# EAGLE design PCFX_Mouse_rev_D (EAGLE 9.6.2)
PC Engine Joypad Breakout Version 1.0
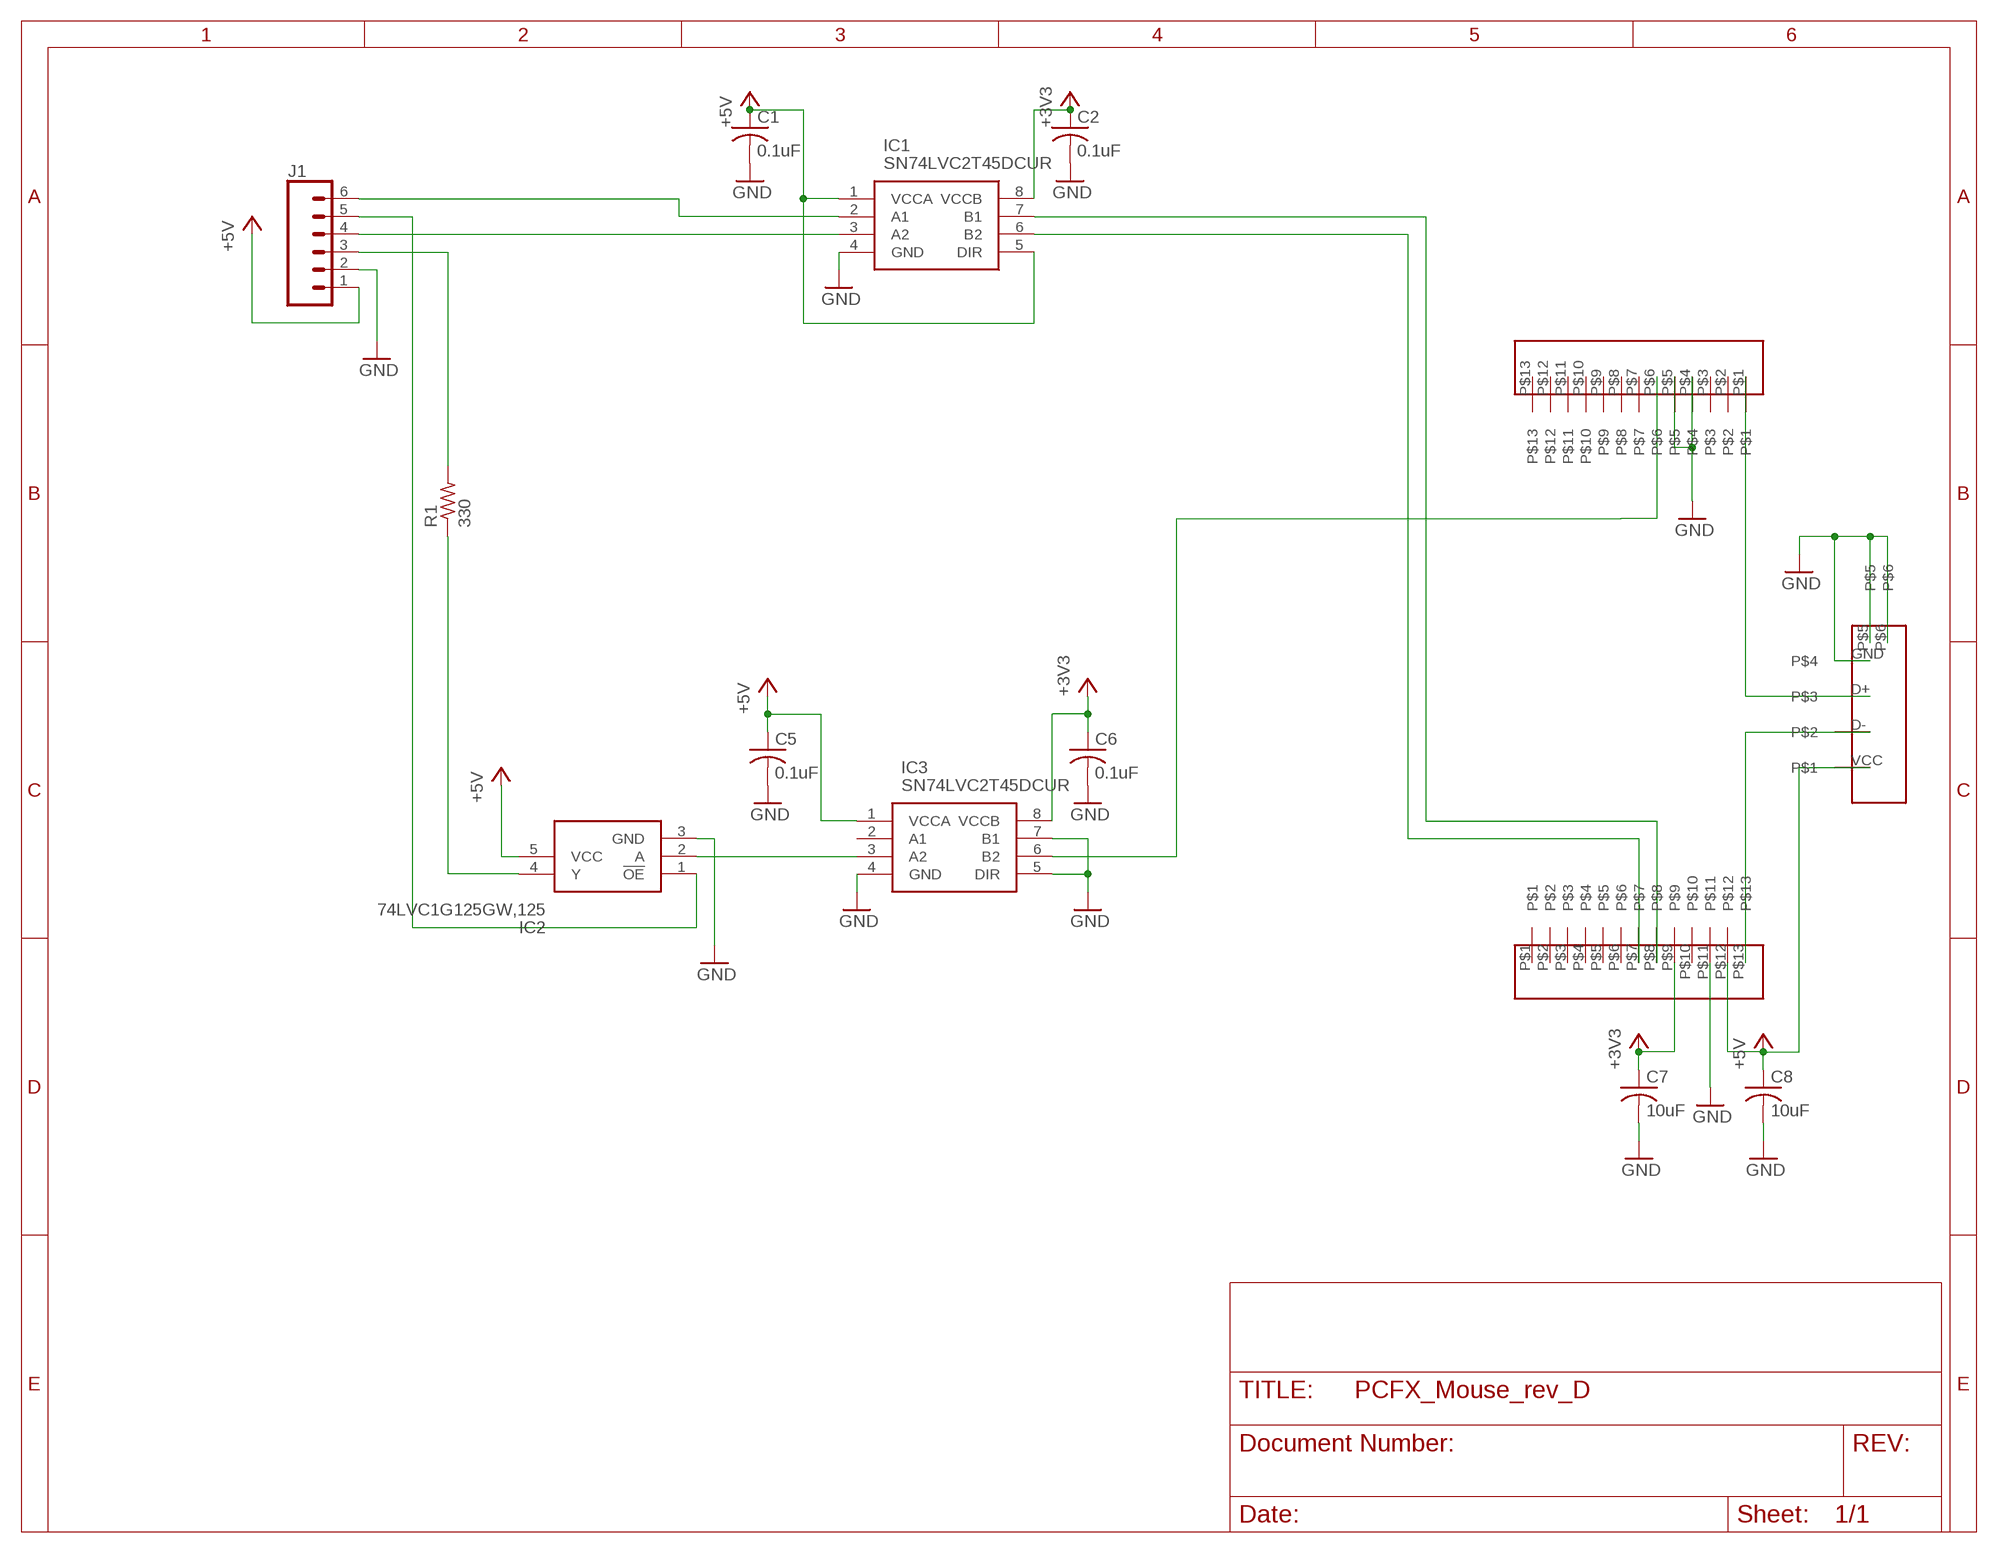
[diagram p0: schematic, sheet 1]

## Parts
C1  0.1uF  C-USC0402  [C0402]
C2  0.1uF  C-USC0402  [C0402]
C5  0.1uF  C-USC0402  [C0402]
C6  0.1uF  C-USC0402  [C0402]
C7  10uF  C-USC0805  [C0805]
C8  10uF  C-USC0805  [C0805]
IC1  SN74LVC2T45DCUR  [SOP50P310X90-8N]
IC2  74LVC1G125GW,125  [SOT65P212X110-5N]
IC3  SN74LVC2T45DCUR  [SOP50P310X90-8N]
J1  CONN_06NO_SILK_FEMALE_PTH  [1X06_NO_SILK]
J2  CONN_1X13  [CONN_1X13]
J3  CONN_1X13  [CONN_1X13]
R1  330  R-US_R0402  [R0402]
U$1  912-121A2026S10100  [912-121A2026S10100]

## Nets
+3V3 [power]: C2.1 C6.1 C7.1 IC1.8(VCCB) IC3.8(VCCB) J2.P$9
+5V [power]: C1.1 C5.1 C8.1 IC1.1(VCCA) IC1.5(DIR) IC2.5(VCC) IC3.1(VCCA) J1.1 J2.P$12 U$1.VCC
CLK [signal]: IC1.3(A2) J1.4
DATA: J1.3 R1.2
GND: C1.2 C2.2 C5.2 C6.2 C7.2 C8.2 IC1.4(GND) IC2.3(GND) IC3.4(GND) IC3.5(DIR) IC3.7(B1) J1.2 J2.P$11 J3.P$4 J3.P$5 U$1.GND U$1.P$5 U$1.P$6
LATCH [signal]: IC1.2(A1) J1.6
N$1: IC2.2(A) IC3.3(A2)
N$2: IC1.7(B1) J2.P$8
N$3: IC3.6(B2) J3.P$6
N$4: J2.P$13 U$1.D-
N$5: IC2.1(!OE) J1.5
N$6: J3.P$1 U$1.D+
N$7: IC1.6(B2) J2.P$7
N$8: IC2.4(Y) R1.1
Unconnected: IC3.2(A1) J2.P$1 J2.P$2 J2.P$3 J2.P$4 J2.P$5 J2.P$6 J2.P$10 J3.P$2 J3.P$3 J3.P$7 J3.P$8 J3.P$9 J3.P$10 J3.P$11 J3.P$12 J3.P$13

## Library data of the parts
C1 C2 C5 C6 = PC-Engine0402:C-US: CAPACITOR, American symbol
C7 C8 = resistor:C-US: CAPACITOR, American symbol
IC1 IC3 = PC-Engine:SN74LVC2T45DCUR: Texas Instruments SN74LVC2T45DCUR, Voltage Level Translator, Bus Transceiver, 3-State, 1.65 5.5 V, 8-Pin UM Source: Datasheet <http://www.ti.com/lit/gpn/sn74lvc2t45>; ARROW_PART_NUMBER: SN74LVC2T45DCUR; ARROW_PRICE-STOCK: https://www.arrow.com/en/products/sn74lvc2t45dcur/texas-instruments?region=nac; DESCRIPTION: Texas Instruments SN74LVC2T45DCUR, Voltage Level Translator, Bus Transceiver, 3-State, 1.65 5.5 V, 8-Pin UM; HEIGHT: 0.9mm; MANUFACTURER_NAME: Texas Instruments; MANUFACTURER_PART_NUMBER: SN74LVC2T45DCUR; MOUSER_PART_NUMBER: 595-SN74LVC2T45DCUR; MOUSER_PRICE-STOCK: https://www.mouser.co.uk/ProductDetail/Texas-Instruments/SN74LVC2T45DCUR?qs=0smPjiIwnfIdG9vxyJHBdA%3D%3D
IC2 = PC-Engine:74LVC1G125GW,125: NXP 74LVC1G125GW,125 Buffer & Line Driver, 3-State, 1.65-5.5V, 5-Pin TSSOP Source: Datasheet <https://assets.nexperia.com/documents/data-sheet/74LVC1G125.pdf>; ARROW_PART_NUMBER: 74LVC1G125GW,125; ARROW_PRICE-STOCK: https://www.arrow.com/en/products/74lvc1g125gw125/nexperia?region=europe; DESCRIPTION: NXP 74LVC1G125GW,125 Buffer & Line Driver, 3-State, 1.65-5.5V, 5-Pin TSSOP; HEIGHT: 1.1mm; MANUFACTURER_NAME: Nexperia; MANUFACTURER_PART_NUMBER: 74LVC1G125GW,125; MOUSER_PART_NUMBER: 771-74LVC1G125GW-G; MOUSER_PRICE-STOCK: https://www.mouser.co.uk/ProductDetail/Nexperia/74LVC1G125GW125?qs=me8TqzrmIYXtmz2PPTYwGg%3D%3D
J1 = SparkFun-Connectors:CONN_06: Multi connection point. Often used as Generic Header-pin footprint for 0.1 inch spaced/style header connections On any of the 0.1 inch spaced packages, you can populate with these: Break Away Headers - Straight <https://www.sparkfun.com/products/116> (PRT-00116) Break Away Male Headers - Right Angle <https://www.sparkfun.com/products/553> (PRT-00553) Female Headers <https://www.sparkfun.com/products/115> (PRT-00115) Break Away Headers - Machine Pin <https://www.sparkfun.com/products/117> (PRT-00117) Break Away Female Headers - Swiss Machine Pin <https://www.sparkfun.com/products/743> (PRT-00743) Arduino Stackable Header - 6 Pin <https://www.sparkfun.com/products/9280> (PRT-09280) For SCREWTERMINALS and SPRING TERMINALS visit here: Screw Terimnals on SparkFun.com <https://www.sparkfun.com/search/results?term=Screw+Terminals> (5mm/3.5mm/2.54mm spacing) This device is also useful as a general connection point to wire up your design to another part of your project. Our various solder wires solder well into these plated through hole pads. Hook-Up Wire - Assortment (Stranded, 22 AWG) <https://www.sparkfun.com/products/11375> (PRT-11375) Hook-Up Wire - Assortment (Solid Core, 22 AWG) <https://www.sparkfun.com/products/11367> (PRT-11367) View the entire wire category on our website here <https://www.sparkfun.com/categories/141>; PROD_ID: CONN-08437
J2 J3 = PC-Engine:CONN_1X13
R1 = PC-Engine0402:R-US_: RESISTOR, American symbol
U$1 = PC-Engine:912-121A2026S10100

## Net classes
0 default: width 0.152 mm, drill 0.356 mm, clearance 0.152 mm
1 power: width 0.305 mm, drill 0.356 mm, clearance 0.152 mm
2 signal: width 0.152 mm, drill 0.356 mm, clearance 0.152 mm

## Board
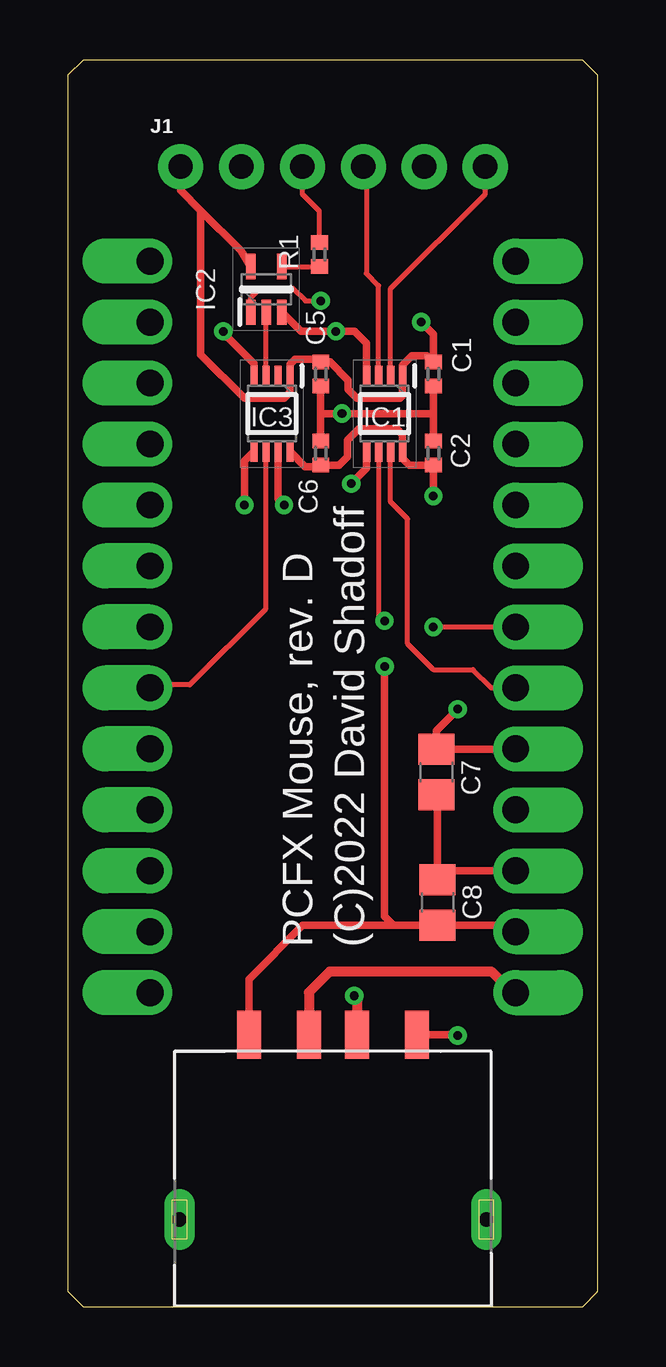
[diagram p1: board, top side]
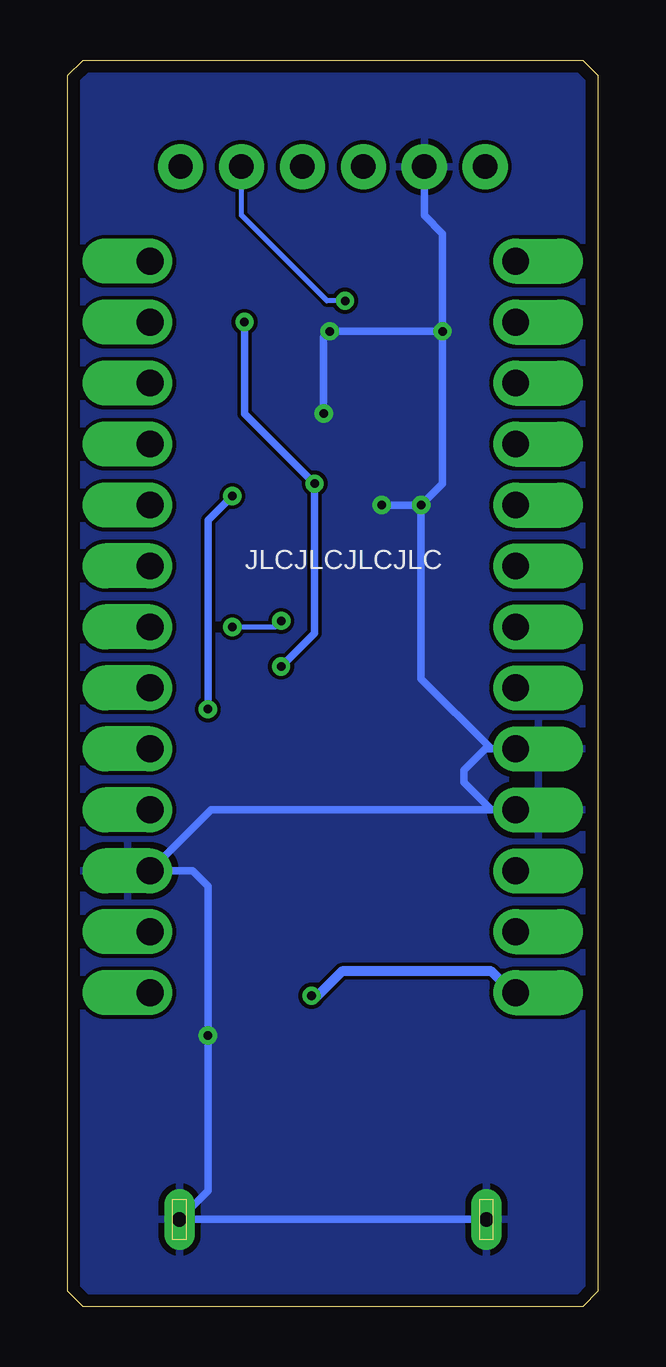
[diagram p2: board, bottom side, seen from below]

Size 22.1 x 51.94 mm. Coordinates in mm from the lower left corner, seen from the top.
Outline: 22.1,0.64 22.1,51.31 21.46,51.94 0.64,51.94 0,51.31 0,0.64 0.64,0 21.46,0 22.1,0.64
Copper layers (1*16): Top 0.035mm / dielectric 1.5mm / Bottom 0.035mm
Design rules "default *": minimum track width 6mil, minimum drill 0.35mm, track to track 6mil, track to pad 6mil, pad to pad 6mil, via to via 6mil, smd to smd 6mil, copper to edge 20mil, drill to drill 6mil, minimum pad ring 10mil, minimum via ring 8mil, stop-mask expansion 3mil, vias tented up to drill 18mil, thermal gap 10mil

### Footprints (pad centres in the part's own frame; a part is rotated, then mirrored left to right if it is on the bottom)
C0402 = smd 0.6 x 0.7: 1 -0.5,0; 2 0.5,0
C0805 = smd 1.3 x 1.5: 1 -0.95,0; 2 0.95,0
SOP50P310X90-8N = smd 0.85 x 0.3: 1 -1.575,0.75; 2 -1.575,0.25; 3 -1.575,-0.25; 4 -1.575,-0.75; 5 1.575,-0.75; 6 1.575,-0.25; 7 1.575,0.25; 8 1.575,0.75
SOT65P212X110-5N = smd 1.05 x 0.4: 1 -0.95,0.65; 2 -0.95,0; 3 -0.95,-0.65; 4 0.95,-0.65; 5 0.95,0.65
1X06_NO_SILK = drill 1.016 pad 1.88: 1 0,0; 2 2.54,0; 3 5.08,0; 4 7.62,0; 5 10.16,0; 6 12.7,0
CONN_1X13 = drill 1.118 pad 1.88 offset: P$1 0,15.24; P$2 0,12.7; P$3 0,10.16; P$4 0,7.62; P$5 0,5.08; P$6 0,2.54; P$7 0,0; P$8 0,-2.54; P$9 0,-5.08; P$10 0,-7.62; P$11 0,-10.16; P$12 0,-12.7; P$13 0,-15.24
R0402 = smd 0.6 x 0.7: 1 -0.5,0; 2 0.5,0
912-121A2026S10100 = smd 1 x 2: D+ 1,6; D- -1,6; GND 3.5,6; VCC -3.5,6 | drill 0.6 pad 1.27 long: P$5 -6.4,-1.7; P$6 6.4,-1.7

### Placement (x,y rotation side)
C1  15.24,38.86 270 top
C2  15.24,35.56 90 top
C5  10.54,38.86 270 top
C6  10.54,35.56 90 top
C7  15.37,22.28 270 top
C8  15.42,16.84 90 top
IC1  13.21,37.21 270 top
IC2  8.27,42.39 90 top
IC3  8.51,37.21 270 top
J1  4.7,47.5 0 top
J2  18.67,28.32 0 top
J3  3.43,28.32 180 top
R1  10.49,43.84 90 top
U$1  11.05,5.33 0 top

### Tracks (layer width: path | path; a pad name or v marks a point on that pad's centre or on a via)
+3V3  (via drill 0.36)
  Top 0.305: IC3.8 9.89,35 10.48,35 C6.1 11.31,35.06 11.66,35.41 11.66,36.09 12.14,36.58 13.72,36.58 13.96,36.33 IC1.8 13.96,35.34 14.24,35.06 C2.1 v15.24,33.78 | J2.P$9 18.65,23.23 C7.1 15.37,24 v16.26,24.89
  Bottom 0.305: v15.24,33.78 16.26,32.77 v16.26,24.89
+5V  (via drill 0.36)
  Top 0.305: IC1.5 12.46,34.94 v11.81,34.29 | v14.73,41.02 15.24,40.51 C1.1 14.98,39.62 14.35,39.62 13.96,39.23 IC1.1 13.96,37.96 13.84,37.85 12.06,37.85 11.68,38.23 11.68,38.61 10.93,39.36 C5.1 10.43,39.47 9.47,39.47 9.26,39.26 IC3.1 9.27,38.77 9.27,38.1 9.02,37.85 7.37,37.85 5.54,39.67 5.54,45.67 | C8.1 18.4,15.89 J2.P$12 | v13.21,26.67 13.21,16.26 13.57,15.89 C8.1 | J1.1 4.7,46.51 5.54,45.67 | 5.54,45.67 7.21,44 IC2.5 | C8.1 9.79,15.89 7.55,13.64 U$1.VCC
  Bottom 0.305: v14.73,41.02 14.73,37.21 v11.81,34.29 11.81,28.07 v13.21,26.67
CLK
  Top 0.203: IC1.3 12.96,42.54 12.45,43.05 12.45,47.37 J1.4
DATA
  Top 0.203: R1.2 10.49,45.64 9.78,46.35 J1.3
GND  (via drill 0.36)
  Top 0.305: 15.24,37.21 v11.43,37.21 10.54,37.21 | IC3.4 7.76,39.29 6.48,40.58 v6.48,40.64 | v7.37,33.4 7.37,35.24 IC3.5 | IC3.7 8.76,33.66 v9.02,33.4 | IC1.4 12.46,40.13 11.95,40.64 v11.18,40.64 9.72,40.64 IC2.3 | C1.2 15.24,37.21 | 15.24,37.21 C2.2 | C6.2 10.54,37.21 | C5.2 10.54,37.21 | J2.P$11 15.79,18.16 C8.2 15.42,21.27 C7.2 | U$1.GND 16.26,11.33 v16.26,11.3
  Bottom 0.305: J1.2 7.24,45.47 6.48,44.7 v6.48,40.64 | v6.48,40.64 6.48,34.29 v7.37,33.4 | v7.37,33.4 v9.02,33.4 | v11.43,37.21 11.43,40.39 v11.18,40.64 v6.48,40.64 | 4.45,20.7 16.13,20.7 J2.P$11 16.89,18.16 16.26,17.53 v16.26,11.3 16.26,4.83 U$1.P$6 U$1.P$5 | 4.45,20.7 5.59,21.84 5.59,22.35 4.7,23.24 J3.P$5 4.45,23.24 7.37,26.16 v7.37,33.4 | 4.45,20.7 J3.P$4
  pour Bottom: -0.64,-0.51 -0.64,52.58 22.86,52.58 22.86,-0.51
LATCH
  Top 0.203: IC1.2 13.46,42.41 17.4,46.35 J1.6
N$1
  Top 0.203: IC3.3 8.26,41.43 IC2.2
N$2
  Top 0.203: J2.P$8 17.65,25.78 16.89,26.54 15.24,26.54 14.16,27.62 14.16,32.83 13.46,33.53 IC1.7
N$3
  Top 0.203: J3.P$6 3.56,25.91 5.08,25.91 8.26,29.09 IC3.6
N$4
  Top 0.406: J2.P$13 18.54,13.08 17.65,13.97 10.92,13.97 10.05,13.1 U$1.D-
N$5  (via drill 0.36)
  Top 0.203: IC2.1 7.62,42.04 8,42.42 9.4,42.42 9.91,41.91 v10.54,41.91
  Bottom 0.203: v10.54,41.91 11.3,41.91 14.86,45.47 J1.5
N$6  (via drill 0.36)
  Top 0.406: v11.94,12.95 12.05,12.84 U$1.D+
  Bottom 0.406: J3.P$1 3.56,13.08 4.45,13.97 10.67,13.97 11.68,12.95 v11.94,12.95
N$7  (via drill 0.36)
  Top 0.203: v13.2,28.57 12.96,28.82 IC1.6 | v15.24,28.32 J2.P$7
  Bottom 0.203: v15.24,28.32 13.46,28.32 v13.2,28.57
N$8
  Top 0.203: IC2.4 R1.1

### Text on the board
tNames: PCFX Mouse, rev. D | (C)2022 David Shadoff
bNames: JLCJLCJLCJLC